# Altium schematic sheet PCM5102A.SchDoc
size A3
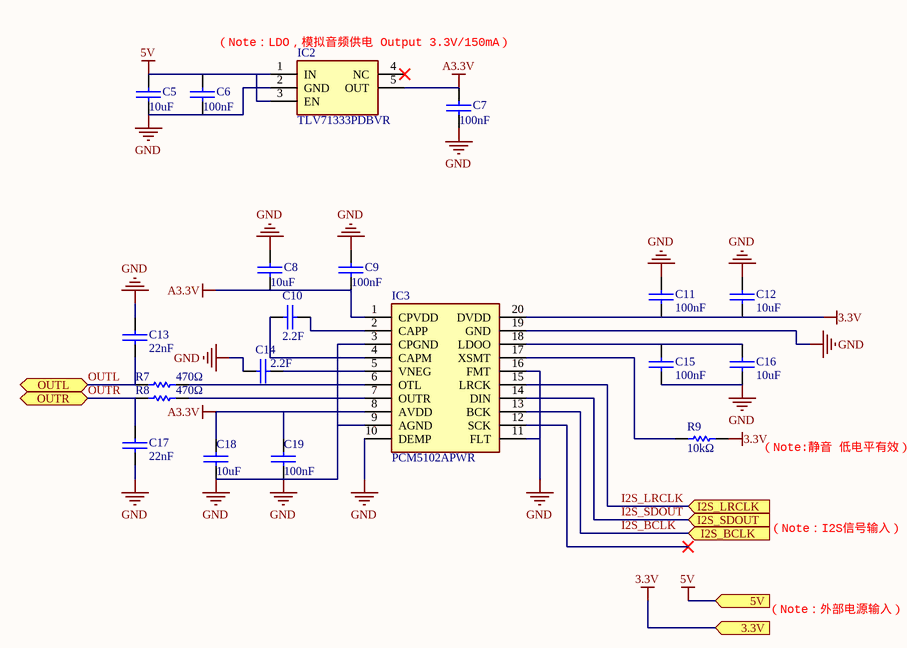
[diagram p0: PCM5102A.SchDoc]

## Parts
C5  10uF  [C_0603]
C6  100nF  [C_0402]
C7  100nF  [C_0402]
C8  10uF  [C_0603]
C9  100nF  [C_0402]
C10  2.2F  [C_0402]
C11  100nF  [C_0402]
C12  10uF  [C_0603]
C13  22nF  [C_0402]
C14  2.2F  [C_0402]
C15  100nF  [C_0402]
C16  10uF  [C_0603]
C17  22nF  [C_0402]
C18  10uF  [C_0603]
C19  100nF  [C_0402]
IC2  TLV71333PDBVR  [SOT95P280X145-5N]
IC3  PCM5102APWR  [SOP65P640X120-20N]
R7  470Ω  [R_0402]
R8  470Ω  [R_0402]
R9  10kΩ  [R_0402]

## Ports
3.3V (in), 5V (in), I2S_BCLK (in), I2S_LRCLK (in), I2S_SDOUT (in), OUTL (bidir), OUTR (bidir)

## Nets
3.3V: C11.1 C12.1 IC3.20(DVDD) R9.1 ; port 3.3V
5V: C5.2 C6.2 IC2.1(IN) IC2.3(EN) ; port 5V
A3.3V: C7.2 C8.1 C9.1 C18.2 C19.2 IC2.5(OUT) IC3.1(CPVDD) IC3.8(AVDD)
GND: C5.1 C6.1 C7.1 C8.2 C9.2 C11.2 C12.2 C13.2 C14.2 C15.1 C16.1 C17.1 C18.1 C19.1 IC2.2(GND) IC3.3(CPGND) IC3.9(AGND) IC3.10(DEMP) IC3.11(FLT) IC3.16(FMT) IC3.19(GND)
I2S_BCLK: IC3.13(BCK) ; port I2S_BCLK
I2S_LRCLK: IC3.15(LRCK) ; port I2S_LRCLK
I2S_SDOUT: IC3.14(DIN) ; port I2S_SDOUT
OUTL: C13.1 R7.2 ; port OUTL
OUTR: C17.2 R8.2 ; port OUTR
NetC10_1: C10.1 IC3.2(CAPP)
NetC10_2: C10.2 IC3.4(CAPM)
NetC14_1: C14.1 IC3.5(VNEG)
NetC15_2: C15.2 C16.2 IC3.18(LDOO)
NetIC3_6: IC3.6(OTL) R7.1
NetIC3_7: IC3.7(OUTR) R8.1
NetIC3_17: IC3.17(XSMT) R9.2

Not connected (* = marked no-connect by the designer): IC2 4(NC)*; IC3 12(SCK)*

## Notes on the sheet
- (near IC2) （Note：LDO，模拟音频供电 Output 3.3V/150mA）
- （Note:静音 低电平有效）
- （Note：I2S信号输入）
- （Note：外部电源输入）

## Library data of the parts
C5-C19 = Cap_Chip: 贴片电容; Manufacturer_Name: *; Manufacturer_Part_Number: *
IC2 = TLV71333PDBVR: Integrated Circuit; Manufacturer_Name: Texas Instruments; Datasheet Link: http://www.ti.com/lit/gpn/tlv713p; Height: 1.45mm; Manufacturer_Part_Number: TLV71333PDBVR; Arrow Part Number: TLV71333PDBVR; Arrow Price/Stock: https://www.arrow.com/en/products/tlv71333pdbvr/texas-instruments; Mouser Part Number: 595-TLV71333PDBVR; Mouser Price/Stock: https://www.mouser.co.uk/ProductDetail/Texas-Instruments/TLV71333PDBVR?qs=FBI%252BX3tnPf1lCQ%252BDbwaFmA%3D%3D
IC3 = PCM5102APWR: Integrated Circuit; Manufacturer_Name: Texas Instruments; Datasheet Link: https://componentsearchengine.com/Datasheets/2/PCM5102APWR.pdf; Height: 1.2mm; Manufacturer_Part_Number: PCM5102APWR; Arrow Part Number: PCM5102APWR; Arrow Price/Stock: https://www.arrow.com/en/products/pcm5102apwr/texas-instruments; Mouser Part Number: 595-PCM5102APWR; Mouser Price/Stock: https://www.mouser.co.uk/ProductDetail/Texas-Instruments/PCM5102APWR?qs=E2%2FxqS9xjzrfECkwEYoiyg%3D%3D
R7-R9 = Res_Chip: 贴片电阻; Manufacturer_Name: *; Manufacturer_Part_Number: *